# Altium schematic sheet Sheet1.SchDoc
size A3; SheetNumber: 1; SheetTotal: 1
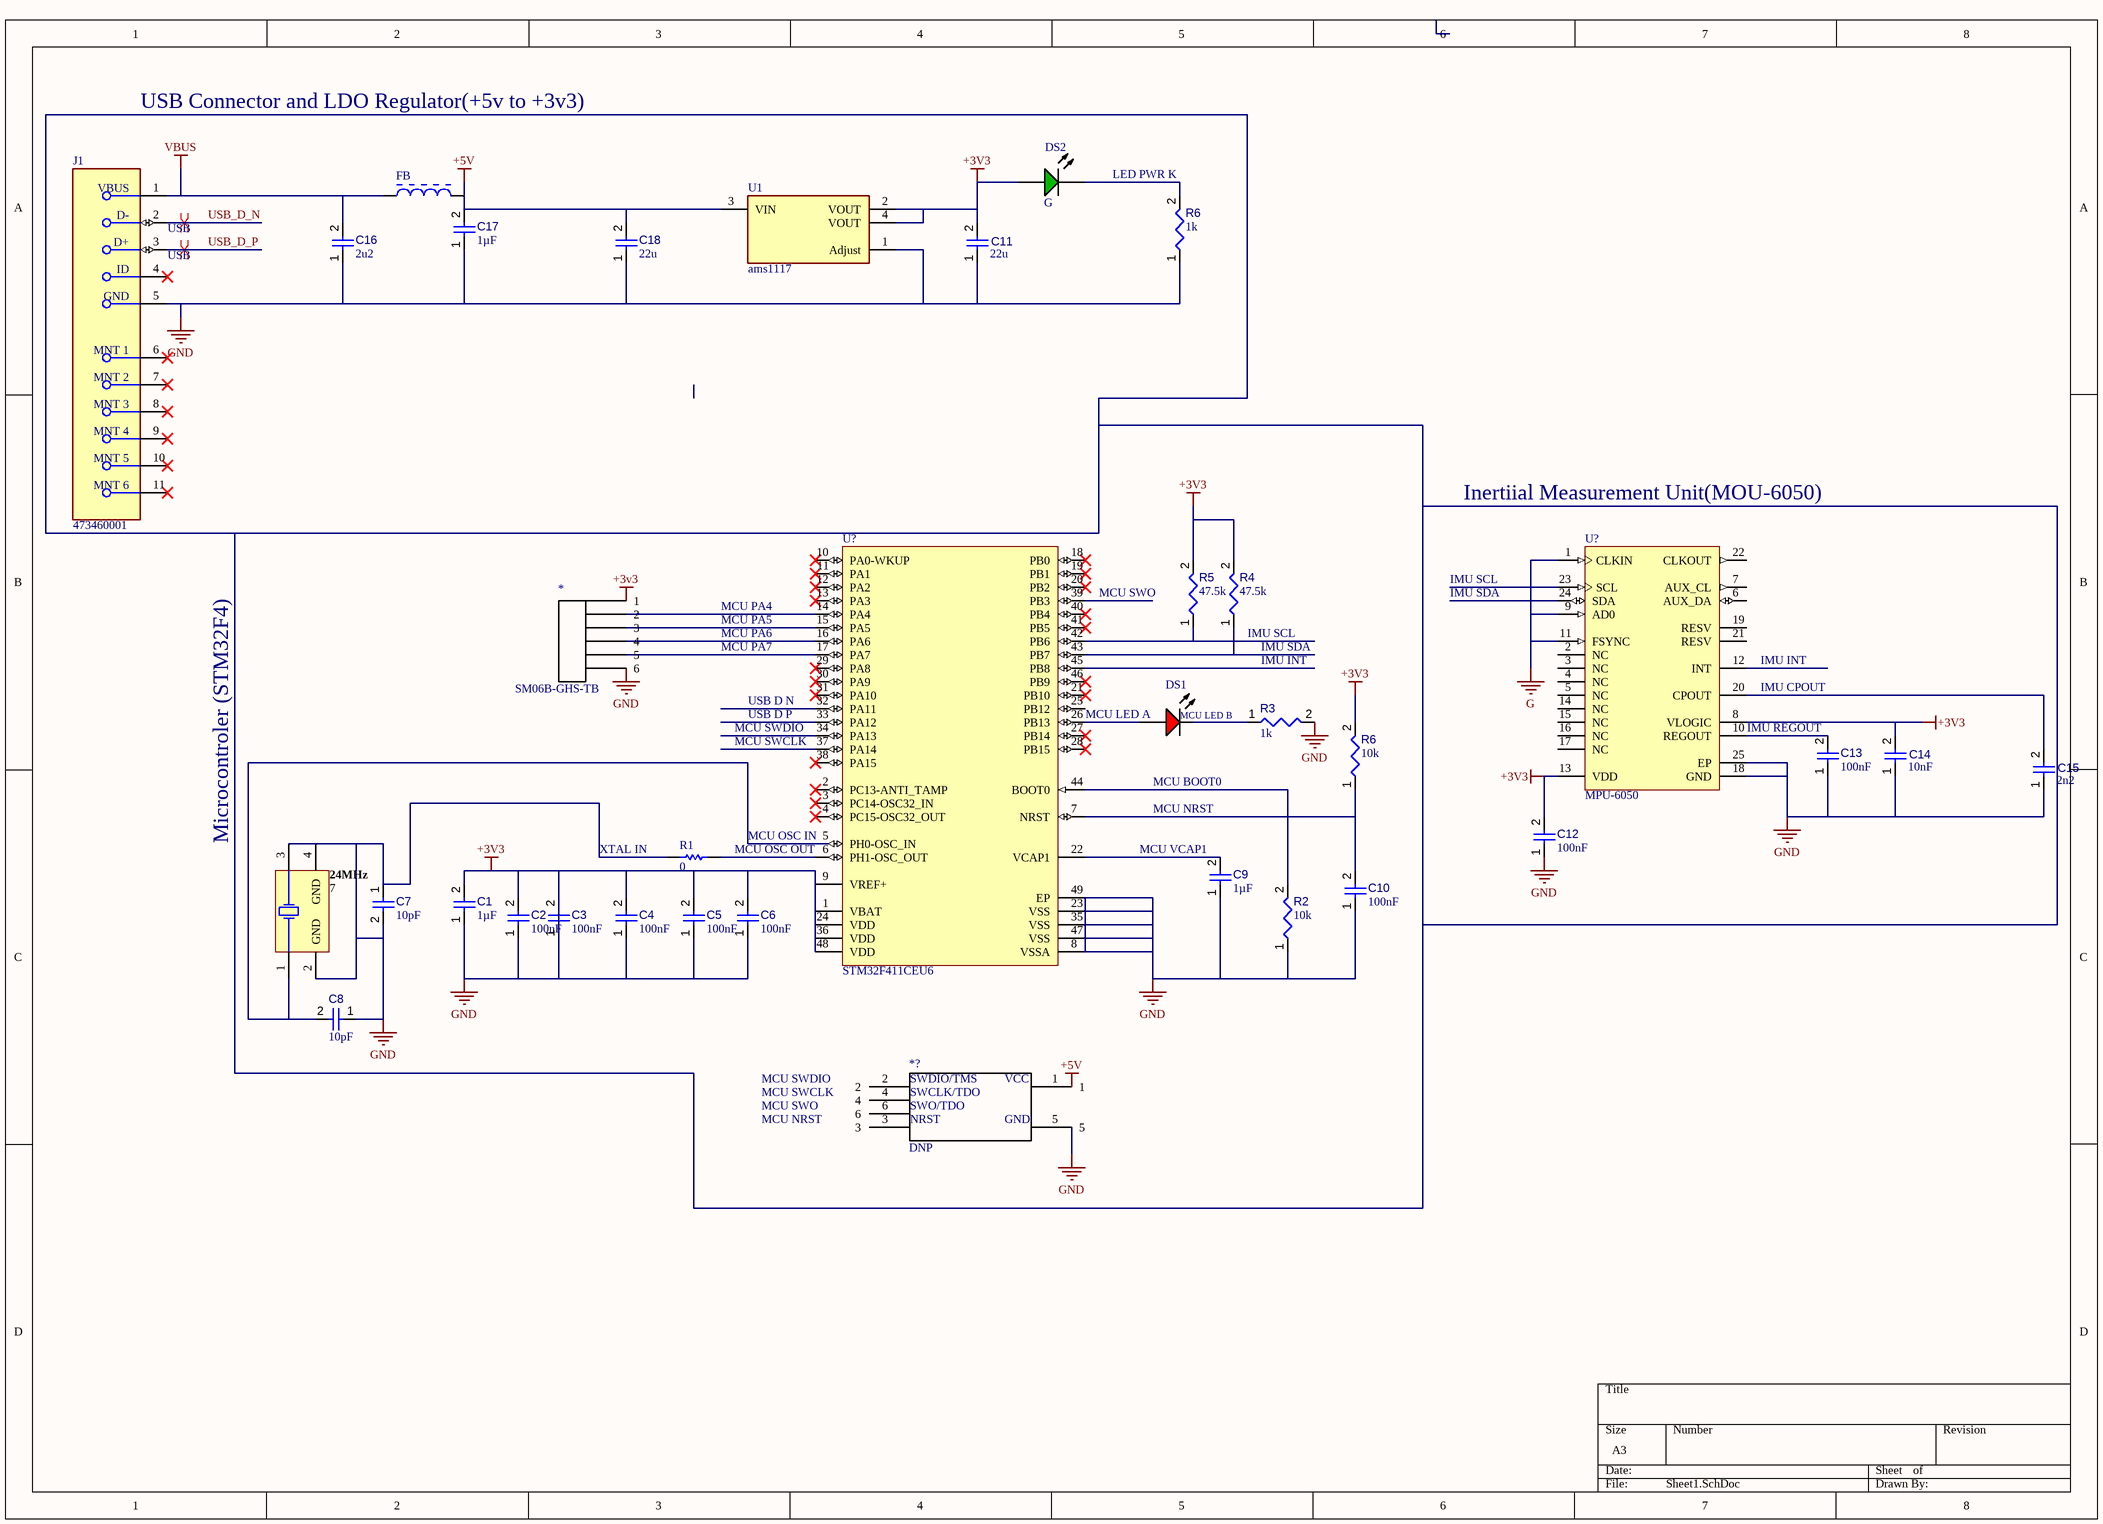
[diagram p0: Sheet1.SchDoc]

## Parts
(Parts that share a designator on the sheet are numbered #1, #2 ... from top to bottom, then left to right.)
24MHz  7  [TXC-7B-4_V]
*  SM06B-GHS-TB  [New footprint 1]
*?  DNP  [MENNA-Footprint-1]
C1  value 1µF  [CAPC2013X135X45NL10T25]  (hidden comment: Capacitor 1 uF +/- 10% 50 V 0805)
C2  value 100nF  [CAPC1608X90X40NL10T20]  (hidden comment: Capacitor 100 nF +/-10% 50 V 0603)
C3  value 100nF  [CAPC1608X90X40NL10T20]  (hidden comment: Capacitor 100 nF +/-10% 50 V 0603)
C4  value 100nF  [CAPC1608X90X40NL10T20]  (hidden comment: Capacitor 100 nF +/-10% 50 V 0603)
C5  value 100nF  [CAPC1608X90X40NL10T20]  (hidden comment: Capacitor 100 nF +/-10% 50 V 0603)
C6  value 100nF  [CAPC1608X90X40NL10T20]  (hidden comment: Capacitor 100 nF +/-10% 50 V 0603)
C7  value 10pF  [CAPC2013X135X45NL10T25]  (hidden comment: Capacitor 10 uF +/- 10% 16 V 0805)
C8  value 10pF  [CAPC2013X135X45NL10T25]  (hidden comment: Capacitor 10 uF +/- 10% 16 V 0805)
C9  value 1µF  [CAPC2013X135X45NL10T25]  (hidden comment: Capacitor 1 uF +/- 10% 50 V 0805)
C10  value 100nF  [CAPC1608X90X40NL10T20]  (hidden comment: Capacitor 100 nF +/-10% 50 V 0603)
C11  value 22u  [CAPC2013X135X45NL10T25]  (hidden comment: Capacitor 1 uF +/- 10% 50 V 0805)
C12  value 100nF  [CAPC1608X90X40NL10T20]  (hidden comment: Capacitor 100 nF +/-10% 50 V 0603)
C13  value 100nF  [CAPC1608X90X40NL10T20]  (hidden comment: Capacitor 100 nF +/-10% 50 V 0603)
C14  value 10nF  [CAPC1608X90X40NL10T20]  (hidden comment: Capacitor 100 nF +/-10% 50 V 0603)
C15  value 2n2  [CAPC1608X90X40NL10T20]  (hidden comment: Capacitor 100 nF +/-10% 50 V 0603)
C16  value 2u2  [CAPC2013X135X45NL10T25]  (hidden comment: Capacitor 1 uF +/- 10% 50 V 0805)
C17  value 1µF  [CAPC2013X135X45NL10T25]  (hidden comment: Capacitor 1 uF +/- 10% 50 V 0805)
C18  value 22u  [CAPC2013X135X45NL10T25]  (hidden comment: Capacitor 1 uF +/- 10% 50 V 0805)
DS1  304090041  [LED-2P-2.28-3MM_A]  (value not drawn)
DS2  G  [CGX-G502DC]
FB  BLM18AG121SN1D  [MURA-BLM18-F-H1-CHIP-2_V]  (value not drawn)
J1  473460001  [FP-473460001-MFG]
R1  value 0  [RESC1608X55X25ML10T15]  (hidden comment: Resistor 0R +/- 5% 0603 100 mW)
R2  value 10k  [RESC1005X40X25ML05T05]  (hidden comment: Resistor 10k +/-1% 0402 63 mW)
R3  value 1k  [RESC0402(1005)_L]  (hidden comment: 47D5KR2F)
R4  value 47.5k  [RESC0402(1005)_L]  (hidden comment: 47D5KR2F)
R5  value 47.5k  [RESC0402(1005)_L]  (hidden comment: 47D5KR2F)
R6#1  value 1k  [RESC0402(1005)_L]  (hidden comment: 25D5KR2F)
R6#2  value 10k  [RESC1005X40X25ML05T05]  (hidden comment: Resistor 10k +/-1% 0402 63 mW)
U1  ams1117  [FP-ams1117-IPC_C]
U?#1  STM32F411CEU6  [STM-UFQFPN48_L]
U?#2  MPU-6050  [IS-QFN-24_V]

## Nets
+3V3: 24MHz.2(GND) 24MHz.3(X2) 24MHz.4(GND) C1.1 C1.2 C2.1 C2.2 C3.1 C3.2 C4.1 C4.2 C5.1 C5.2 C6.1 C6.2 C7.1 C7.2 C8.1 C9.1 C10.1 C11.1 C11.2 C12.1 C12.2 C13.1 C14.1 C14.2 C15.1 C16.1 C17.1 C18.1 DS2.1(A) J1.5(GND) R1.1 R2.1 R3.2 R4.2 R5.2 R6#1.1 R6#2.2 U1.1(Adjust) U1.2(VOUT) U1.4(VOUT) U?#1.1(VBAT) U?#1.8(VSSA) U?#1.9(VREF+) U?#1.23(VSS) U?#1.24(VDD) U?#1.35(VSS) U?#1.36(VDD) U?#1.47(VSS) U?#1.48(VDD) U?#1.49(EP) U?#2.8(VLOGIC) U?#2.13(VDD) U?#2.18(GND) U?#2.25(EP)  [also labelled GND]
+5V: C17.2 C18.2 FB.2 U1.3(VIN)
G: U?#2.1(CLKIN) U?#2.9(AD0) U?#2.11(FSYNC)
VBUS: C16.2 FB.1 J1.1(VBUS)
USB_D_N: J1.2(D-)
USB_D_P: J1.3(D+)
Net24MHz_1: 24MHz.1(X1) C8.2 U?#1.5(PH0-OSC_IN)
NetC9_2: C9.2 U?#1.22(VCAP1)
NetC10_2: C10.2 R6#2.1 U?#1.7(NRST)
NetC13_2: C13.2 U?#2.10(REGOUT)
NetC15_2: C15.2 U?#2.20(CPOUT)
NetDS1_1: DS1.1(A) U?#1.26(PB13)
NetDS1_2: DS1.2(K) R3.1
NetDS2_2: DS2.2(K) R6#1.2
NetR1_2: R1.2 U?#1.6(PH1-OSC_OUT)
NetR2_2: R2.2 U?#1.44(BOOT0)
NetR4_1: R4.1 U?#1.43(PB7)
NetR5_1: R5.1 U?#1.42(PB6)

Not connected (* = marked no-connect by the designer): * ?1(1) ?2(2) ?3(3) ?4(4) ?5(5) ?6(6); *? 1 2 3 4 5 6; J1 4(ID)* 6(MNT_1)* 7(MNT_2)* 8(MNT_3)* 9(MNT_4)* 10(MNT_5)* 11(MNT_6)*; U?#1 2(PC13-ANTI_TAMP)* 3(PC14-OSC32_IN)* 4(PC15-OSC32_OUT)* 10(PA0-WKUP)* 11(PA1)* 12(PA2)* 13(PA3)* 14(PA4) 15(PA5) 16(PA6) 17(PA7) 18(PB0)* 19(PB1)* 20(PB2)* 21(PB10)* 25(PB12) 27(PB14)* 28(PB15)* 29(PA8)* 30(PA9)* 31(PA10)* 32(PA11) 33(PA12) 34(PA13) 37(PA14) 38(PA15)* 39(PB3) 40(PB4)* 41(PB5)* 45(PB8) 46(PB9)*; U?#2 2(NC) 3(NC) 4(NC) 5(NC) 6(AUX_DA) 7(AUX_CL) 12(INT) 14(NC) 15(NC) 16(NC) 17(NC) 19(RESV) 21(RESV) 22(CLKOUT) 23(SCL) 24(SDA)

## Layout directives
differential pair; differential pair class USB: USB_D_N
differential pair; differential pair class USB; differential pair class USB: USB_D_P

## Notes on the sheet
- USB Connector and LDO Regulator(+5v to +3v3)
- (near R6#1) LED PWR K
- Inertiial Measurement Unit(MOU-6050)
- MCU SWO
- IMU SCL
- IMU SDA
- MCU PA4
- MCU PA5
- MCU PA6
- MCU PA7
- (near R4) IMU SCL
- (near R4) IMU SDA
- IMU INT
- (near U?#2) IMU INT
- (near U?#1) MCU SWDIO
- (near U?#1) USB D N
- (near U?#1) USB D P
- MCU LED A
- (near DS1) MCU LED B
- IMU REGOUT
- IMU CPOUT
- (near U?#1) MCU SWCLK
- MCU BOOT0
- Microcontroler (STM32F4)
- XTAL IN
- MCU OSC OUT
- MCU OSC IN
- (near C9) MCU VCAP1
- MCU NRST
- (near *?) MCU SWDIO
- (near *?) MCU SWCLK
- Labels drawn without touching a wire or pin: +3v3, +5V, GND
- (in symbol CMP-002-00071-1) SWDIO/TMS; VCC; SWCLK/TDO; SWO/TDO; NRST; GND

## Library data of the parts
24MHz = CMP-003-00011-2: SMD Seam Sealing Crystal, 24 MHz, +/- 30 ppm, 18 pF, -10 to 70 degC, 4-Pin SMD, RoHS, Tape and Reel; Manufacturer: TXC; Resistance: 40Ohm; Frequency: 24MHz; Tolerance: 30ppm; ESR: 40; Load Capacitance: 18pF; Package Description: 4-Pin Surface Mount Device, Body 5 x 3.2 mm, Pitch 3.7 mm; Pins: 4; Mounting Technology: SM; Package Reference: 7B-4; Max Operating Temperature: 70°C; Package Quantity: 1000; Min Operating Temperature: -20°C; Datasheet URL: http://www.txccorp.com/download/products/quartz_crystals/2015TXC_7B_19.pdf; RoHS Compliant: True; Datasheet Version: Jul-15; Case/Package: 7B-4; Packaging: TapeandReel; Frequency Tolerance: 30ppm
* = CMP-002-00072-3
*? = CMP-002-00071-1
C1 C9 C11 C16-C18 = CMP-001-00007-6: Chip Capacitor, 1 uF, +/- 10%, 50 V, 0805 (2012 Metric); Capacitor Type: Ceramic; Voltage Rating: 50V; Min Operating Temperature: -55°C; RoHS Compliant: True; Mounting Technology: SM; Case/Package: 0805; Max Operating Temperature: 125°C; Tolerance: 10%; Pins: 2
C2-C6 C10 C12-C15 = CMP-001-00017-6: Chip Capacitor, 100 nF, +/- 10%, 50 V, 0603 (1608 Metric); Voltage Rating: 50V; Capacitor Type: Ceramic; Tolerance: 10%; Mounting Technology: SM; Max Operating Temperature: 125°C; RoHS Compliant: True; Pins: 2; Case/Package: 0603; Min Operating Temperature: -55°C
C7 C8 = CMP-001-00015-6: Chip Capacitor, 10 uF, +/- 10%, 16 V, 0805 (2012 Metric); Voltage Rating: 16V; Capacitor Type: Ceramic; RoHS Compliant: True; Max Operating Temperature: 85°C; Min Operating Temperature: -55°C; Mounting Technology: SM; Tolerance: 10%; Case/Package: 0805; Pins: 2
DS1 = CMP-007-00007-2: Red LED, 80 mW, 30 mA, -25 to 85 degC, 2-Pin THD; Manufacturer: Shenzhen CGX; Package Description: 2-Pin Through Hole Device, Dia 3 mm, Pitch 2.28 mm; Datasheet URL: http://datasheet.octopart.com/304090041-Chengguangxing-datasheet-62330656.pdf; Mounting Technology: TH; Manufacturer URL: http://szcgx.com/; RoHS Compliant: Unknown; Datasheet Version: Sep-14; Case/Package: 304090041; Package Reference: 304090041
DS2 = CMP-007-00008-2: Green LED, 80 mW, 20 mA, -25 to 85 degC, 2-Pin THD; Manufacturer: Shenzhen CGX; Mounting Technology: TH; Package Reference: G502DC; Datasheet Version: Sep-14; Manufacturer URL: http://szcgx.com/; Package Description: 2-Pin Through Hole Device, Dia 5.9 mm; Datasheet URL: http://datasheet.octopart.com/G502DC-Chengguangxing-datasheet-62330340.pdf; Case/Package: G502DC; RoHS Compliant: Unknown
FB = CMP-006-00004-3: Chip Ferrite Bead for General Use, 120 Ohm, 500 mA, -55 to 125 degC, 0603 (1608 Metric), RoHS, Tape and Reel; Manufacturer: Murata; Max Current Rating: 500mA; Tolerance: 25%; Impedance: 120Ohm; Resistance: 200mohm; Min Operating Temperature: -55°C; Package Reference: BLM18_H950-2; Max Operating Temperature: 125°C; Current Rating: 500mA; Core Material: Ferrite; Datasheet Version: Jun-12; Packaging: TapeandReel; Datasheet URL: https://statics3.seeedstudio.com/images/opl/datasheet/303010016.pdf; Package Quantity: 4000; Case/Package: 0603; RoHS Compliant: True
J1 = CMP-2000-05246-2: CONN RCPT USB2.0 MICRO B SMD R/A; Manufacturer: Molex; Conn Orientation: Right Angle; Is Female: yes; Shielding: true; Pitch: 0.65mm; Number Of Contacts: 5; Voltage Rating: 30V; Current Rating: 1.8A; Device Class L2: USB Connectors; Digikey Description: CONN RCPT USB2.0 MICRO B SMD R/A; Height: 2.945mm; RoHS: TRUE; ComponentLink2Description: Datasheet; Octopart: https://octopart.com/47346-0001-molex-7164928; Automotive: No; Package: 0; Category: Conn; Device Class L1: Connectors; Usb Standard: USB 2.0; Temperature: -30°C to +85°C; Temperature Range Low: -30°C; Footprint Url: https://www.molex.com/pdm_docs/sd/473460001_sd.pdf; ComponentLink2URL: https://www.molex.com/webdocs/datasheets/pdf/en-us/0473460001_IO_CONNECTORS.pdf; Lead Free: Yes; Manufacturer Part Number: 473460001; Contact Material: Gold,Nickel; Temperature Range High: +85°C; Device Class L3: unset
R1 = CMP-009-00006-5: Chip Resistor, 0 Ohm, 0.1 W, -55 to 155 degC, 0603 (1608 Metric); Power: 100mW; Voltage Rating: 50V; Max Operating Temperature: 155°C; RoHS Compliant: True; Mounting Technology: SM; Case/Package: 0603; Min Operating Temperature: -55°C; Tolerance: 5%; Pins: 2
R2 R6#2 = CMP-009-00019-5: Chip Resistor, 10 KOhm, +/- 1%, 63 mW, -55 to 155 degC, 0402 (1005 Metric); Power: 63mW; Voltage Rating: 50V; Case/Package: 0402; Mounting Technology: SM; Pins: 2; Min Operating Temperature: -55°C; Tolerance: 1%; RoHS Compliant: True; Max Operating Temperature: 155°C
R3-R5 = CMP-009-00103-2: 47K5 0.063W 1% 0402 (1005 Metric)  SMD; Power: 63mW; Pins: 2; Tolerance: 1%; Mounting Technology: SMT; Case/Package: 0402
R6#1 = CMP-009-00085-2: 25K5 0.063W 1% 0402 (1005 Metric)  SMD; Power: 63mW; Tolerance: 1%; Pins: 2; Mounting Technology: SMT; Case/Package: 0402
U1 = CMP-209535-000002-1: 1A LOW DROPOUT VOLTAGE REGULATOR; RoHS Compliant: Yes
U?#1 = CMP-0243-00165-1: ARM Cortex-M4 32-bit MCU+FPU, 512 KB Flash, 128 KB RAM, 36 I/Os, 48-Pin UFQFPN, -40 to 85 degC, Tray; Operating Frequency(F) (Processor speed) (MHz): 100; FLASH Size (Prog) (kB): 512; Internal RAM Size (kB): 128; I/Os (High Current): 36; Supply Voltage(Vcc) min (V): 1.7; Package Reference: 48-Pin Ultra Thin Fine Pitch Quad Flat No-Lead, 7 x 7 x 0.6 mm Body, 0.5 mm Pitch, Exposed Pad; ComponentLink1Description: Manufacturer URL; ComponentLink1URL: http://www.st.com/; Packing: Tray; Package Description: UFQFPN48; Core: ARM Cortex-M4; ComponentLink2Description: Datasheet; ComponentLink2URL: http://www.st.com/st-web-ui/static/active/en/resource/technical/document/datasheet/DM00115249.pdf; DatasheetVersion: Rev. 6; Mounting Technology: Surface Mount
U?#2 = CMP-1753-00002-2: 3-Axis Gyroscope, Accelerometer and a Digital Motion Processor(TM) (DMP), 2.375 to 3.46 V, -40 to 85 degC, 24-Pin QFN, RoHS, Tape and Reel; Manufacturer: InvenSense; Featured Product: MPU-60506-Axis,IntegratedI²CSolution; Other Names: 1428-1007-2 / MPU6050; Sensor Type: MotionTracking; Online Catalog: MPU-6000™Series; Unit PriceUSD: Digital; Datasheet Version: Rev. 3.3, 05/2012; Category: Sensors,Transducers; Datasheet URL: http://datasheet.octopart.com/MPU-6050-InvenSense-datasheet-14421344.pdf; Family: Multifunction; Standard Package: 5,000; Manufacturer URL: http://www.invensense.com/; Output Type: Digital; Dynamic Catalog: MPU-6000™Series